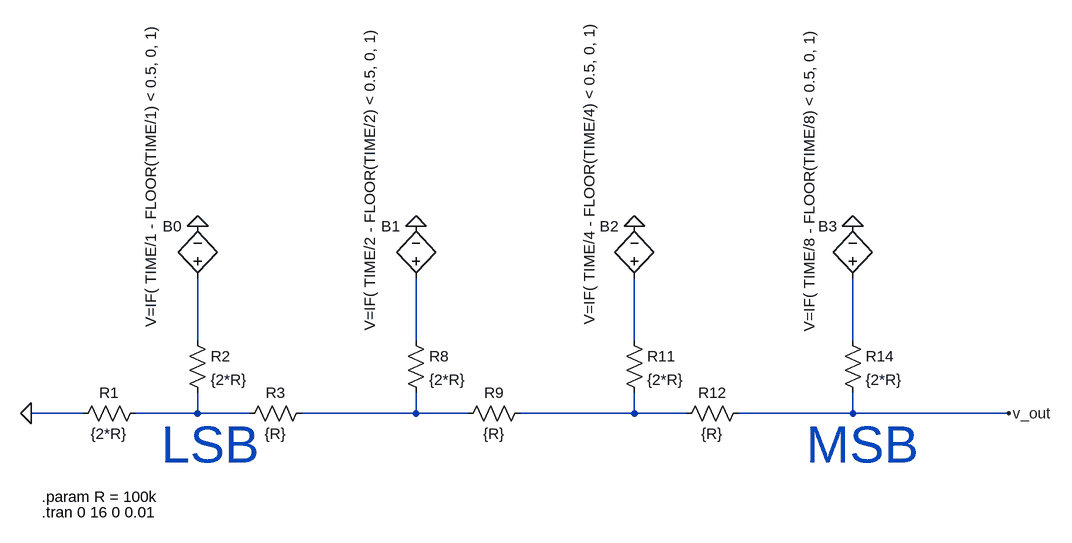
[diagram p0: schematic 4bit_dac.asc]
4bit_dac.asc, the LTspice schematic file:
Version 4
SHEET 1 1748 1164
WIRE 64 32 64 -64
WIRE 400 32 400 -64
WIRE 736 32 736 -64
WIRE 1072 32 1072 -64
WIRE -112 144 -192 144
WIRE 64 144 64 112
WIRE 64 144 -32 144
WIRE 144 144 64 144
WIRE 400 144 400 112
WIRE 400 144 224 144
WIRE 480 144 400 144
WIRE 736 144 736 112
WIRE 736 144 560 144
WIRE 816 144 736 144
WIRE 1072 144 1072 112
WIRE 1072 144 896 144
WIRE 1312 144 1072 144
FLAG 64 -144 0
FLAG 400 -144 0
FLAG 736 -144 0
FLAG 1072 -144 0
FLAG -192 144 0
FLAG 1312 144 v_out
SYMBOL res -16 128 R90
WINDOW 0 0 56 VBottom 2
WINDOW 3 32 56 VTop 2
SYMATTR InstName R1
SYMATTR Value {2*R}
SYMBOL res 48 16 R0
SYMATTR InstName R2
SYMATTR Value {2*R}
SYMBOL res 240 128 R90
WINDOW 0 0 56 VBottom 2
WINDOW 3 32 56 VTop 2
SYMATTR InstName R3
SYMATTR Value {R}
SYMBOL res 384 16 R0
SYMATTR InstName R8
SYMATTR Value {2*R}
SYMBOL res 576 128 R90
WINDOW 0 0 56 VBottom 2
WINDOW 3 32 56 VTop 2
SYMATTR InstName R9
SYMATTR Value {R}
SYMBOL res 720 16 R0
SYMATTR InstName R11
SYMATTR Value {2*R}
SYMBOL res 912 128 R90
WINDOW 0 0 56 VBottom 2
WINDOW 3 32 56 VTop 2
SYMATTR InstName R12
SYMATTR Value {R}
SYMBOL res 1056 16 R0
SYMATTR InstName R14
SYMATTR Value {2*R}
SYMBOL bv 64 -48 R180
WINDOW 0 24 96 Left 2
WINDOW 3 72 -60 VRight 2
SYMATTR InstName B0
SYMATTR Value V=IF( TIME/1 - FLOOR(TIME/1) < 0.5, 0, 1)
SYMBOL bv 400 -48 R180
WINDOW 0 24 96 Left 2
WINDOW 3 71 -65 VRight 2
SYMATTR InstName B1
SYMATTR Value V=IF( TIME/2 - FLOOR(TIME/2) < 0.5, 0, 1)
SYMBOL bv 736 -48 R180
WINDOW 0 24 96 Left 2
WINDOW 3 69 -56 VRight 2
SYMATTR InstName B2
SYMATTR Value V=IF( TIME/4 - FLOOR(TIME/4) < 0.5, 0, 1)
SYMBOL bv 1072 -48 R180
WINDOW 0 24 96 Left 2
WINDOW 3 67 -67 VRight 2
SYMATTR InstName B3
SYMATTR Value V=IF( TIME/8 - FLOOR(TIME/8) < 0.5, 0, 1)
TEXT -176 296 Left 2 !.tran 0 16 0 0.01
TEXT -176 272 Left 2 !.param R = 100k
TEXT 1000 192 Left 6 ;MSB
TEXT 8 192 Left 6 ;LSB

The netlist it stands for:
* 4bit_dac.asc
R1 N005 0 {2*R}
R2 N001 N005 {2*R}
R3 N006 N005 {R}
R8 N002 N006 {2*R}
R9 N007 N006 {R}
R11 N003 N007 {2*R}
R12 v_out N007 {R}
R14 N004 v_out {2*R}
B0 N001 0 V=IF( TIME/1 - FLOOR(TIME/1) < 0.5, 0, 1)
B1 N002 0 V=IF( TIME/2 - FLOOR(TIME/2) < 0.5, 0, 1)
B2 N003 0 V=IF( TIME/4 - FLOOR(TIME/4) < 0.5, 0, 1)
B3 N004 0 V=IF( TIME/8 - FLOOR(TIME/8) < 0.5, 0, 1)
.tran 0 16 0 0.01
.param R = 100k
* MSB
* LSB
.backanno
.end